# EAGLE design BAR30-SENSOR (EAGLE 7.4.0)
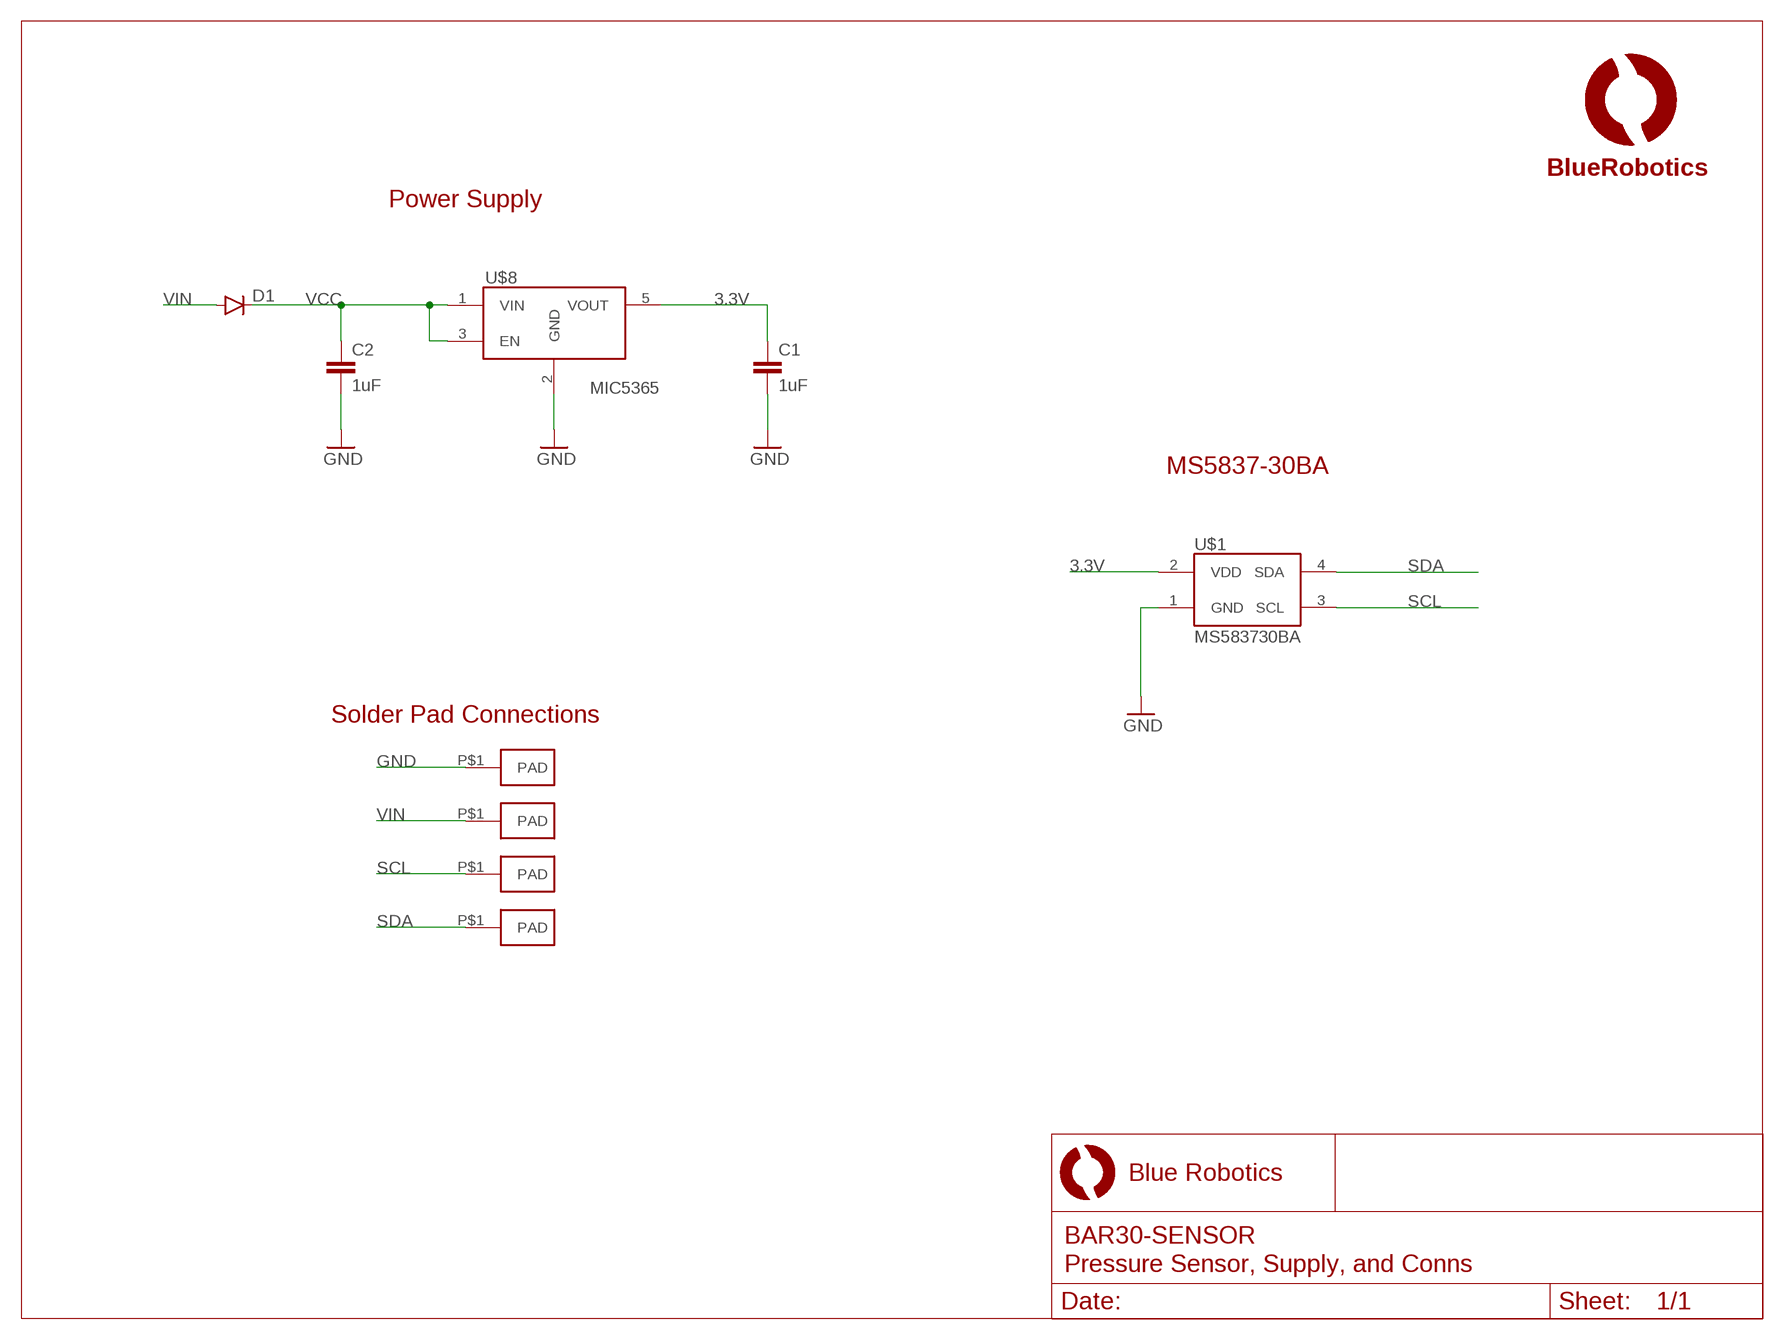
[diagram p0: schematic, sheet 1]

## Parts
C1  1uF  C-EUC0402  [C0402]
C2  1uF  C-EUC0402  [C0402]
D1  DIODESOD523  [SOD523]
U$1  MS583730BA  [MS5837]
U$3  PAD1.5X3MM  [PAD-1.5X3MM]
U$4  PAD1.5X3MM  [PAD-1.5X3MM]
U$5  PAD1.5X3MM  [PAD-1.5X3MM]
U$6  PAD1.5X3MM  [PAD-1.5X3MM]
U$7  LOGOBR-LOGO-S  [BR-LOGO-SMALL]
U$8  VREG-MIC5365  [SC70-5L]

## Nets
3.3V: C1.1 U$1.2(VDD) U$8.5(VOUT)
GND: C1.2 C2.2 U$1.1(GND) U$3.P$1(PAD) U$8.2(GND)
SCL: U$1.3(SCL) U$5.P$1(PAD)
SDA: U$1.4(SDA) U$6.P$1(PAD)
VCC: C2.1 D1.C U$8.1(VIN) U$8.3(EN)
VIN: D1.A U$4.P$1(PAD)

## Notes on the sheet
- Power Supply
- MIC5365
- MS5837-30BA
- Solder Pad Connections

## Library data of the parts
C1 C2 = resistor:C-EU: CAPACITOR, European symbol
D1 = SparkFun-DiscreteSemi:DIODE: Diode These are standard reverse protection diodes and small signal diodes. SMA package can handle up to about 1A. SOD-323 can handle about 200mA. What the SOD-323 package when ordering, there are some mfgs out there that are 5-pin packages.
U$1 = BR-Eagle-Library:MS5837
U$3-U$6 = BR-Eagle-Library:PAD
U$7 = BR-Eagle-Library:LOGO
U$8 = BlueRobotics-Main:VREG-MIC5365

## Board
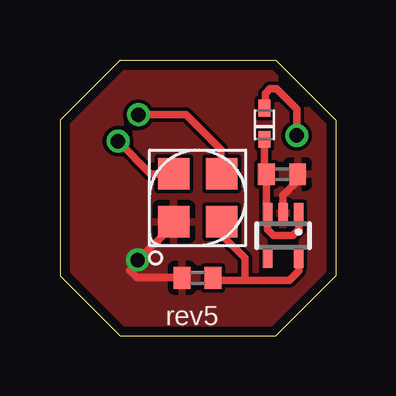
[diagram p1: board, top side]
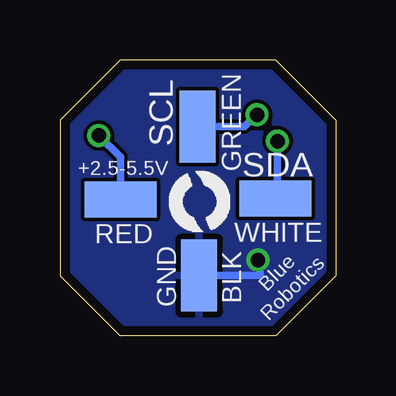
[diagram p2: board, bottom side, seen from below]

Size 11.5 x 11.5 mm. Coordinates in mm from the lower left corner, seen from the top.
Outline: 0,2.5 2.5,0 9,0 11.5,2.5 11.5,9 9,11.5 2.5,11.5 0,9 0,2.5
Copper layers (1*16): Top 0.0356mm / dielectric 1.5011mm / Bottom 0.0356mm
Design rules "OSHPark *": minimum track width 6mil, minimum drill 13mil, track to track 6mil, track to pad 6mil, pad to pad 6mil, via to via 6mil, smd to smd 6mil, copper to edge 15mil, drill to drill 6mil, minimum pad ring 7mil, minimum via ring 7mil, stop-mask expansion 3mil, vias tented up to drill 30mil, thermal gap 10mil

### Footprints (pad centres in the part's own frame; a part is rotated, then mirrored left to right if it is on the bottom)
C0402 = smd 0.7 x 0.9: 1 -0.65,0; 2 0.65,0
SOD523 = smd 0.7 x 0.5: A 0.7,0; C -0.6,0
MS5837 = smd 1.3 x 1.3: 1 -1,1; 2 -1,-1; 3 1,-1; 4 1,1
PAD-1.5X3MM = smd 3 x 1.5: P$1 0,0
SC70-5L = smd 0.4 x 0.8: 1 -0.65,-0.95; 2 0,-0.95; 3 0.65,-0.95; 4 0.65,0.95; 5 -0.65,0.95

### Placement (x,y rotation side)
C1  5.74,2.41 180 top
C2  9.27,6.73 0 top
D1  8.53,8.79 90 top
U$1  5.75,5.75 90 top
U$3  5.69,2.5 270 bottom
U$4  8.97,5.68 180 bottom
U$5  5.76,8.71 270 bottom
U$6  2.51,5.72 0 bottom
U$7  6.94,4.34 0 bottom
U$8  9.31,4.17 180 top

### Tracks (layer width: path | path; a pad name or v marks a point on that pad's centre or on a via)
3.3V
  Top 0.305: U$8.5 9.96,2.7 9.57,2.3 7.72,2.3 | 7.72,2.3 6.5,2.3 C1.1 | U$1.2 6.75,4.21 7.72,3.24 7.72,2.3
GND  (via drill 0.6)
  Top 0.305: C1.2 5.07,2.42 3.19,2.42 2.9,2.72 v3.24,3.15 4.75,4.6 U$1.1 | C2.2 9.92,6.46 9.3,5.85 U$8.2
  Bottom 0.305: U$3.P$1 3.14,2.5 v3.24,3.15
  pour Bottom: -1.36,13.85 16.42,13.85 16.42,-3.93 -1.36,-3.93
  pour Top: -3.9,13.85 13.88,13.85 13.88,-1.39 -3.9,-1.39
SCL  (via drill 0.6)
  Top 0.305: v3.28,9.21 5.27,9.21 6.72,7.76 6.72,6.78 U$1.3
  Bottom 0.305: U$5.P$1 3.8,8.72 v3.28,9.21
SDA  (via drill 0.6)
  Top 0.305: U$1.4 3.78,6.75 v2.42,8.11
  Bottom 0.305: v2.42,8.11 2.42,5.81 U$6.P$1
VCC
  Top 0.305: D1.C 8.53,6.82 C2.1 8.62,5.16 U$8.3 8.66,4.42 8.91,4.18 9.72,4.18 9.96,4.42 U$8.1
VIN  (via drill 0.6)
  Top 0.305: v9.88,8.35 9.88,9.44 9.03,10.29 8.76,10.29 8.57,10.1 8.57,9.53 D1.A
  Bottom 0.305: U$4.P$1 8.97,7.44 v9.88,8.35

### Text on the board
tPlace: rev5
bPlace: SCL | GREEN | SDA | +2.5-5.5V | WHITE | RED | Blue / Robotics | BLK | GND